# EAGLE design Arduinoboy_1 (EAGLE 7.3.0)
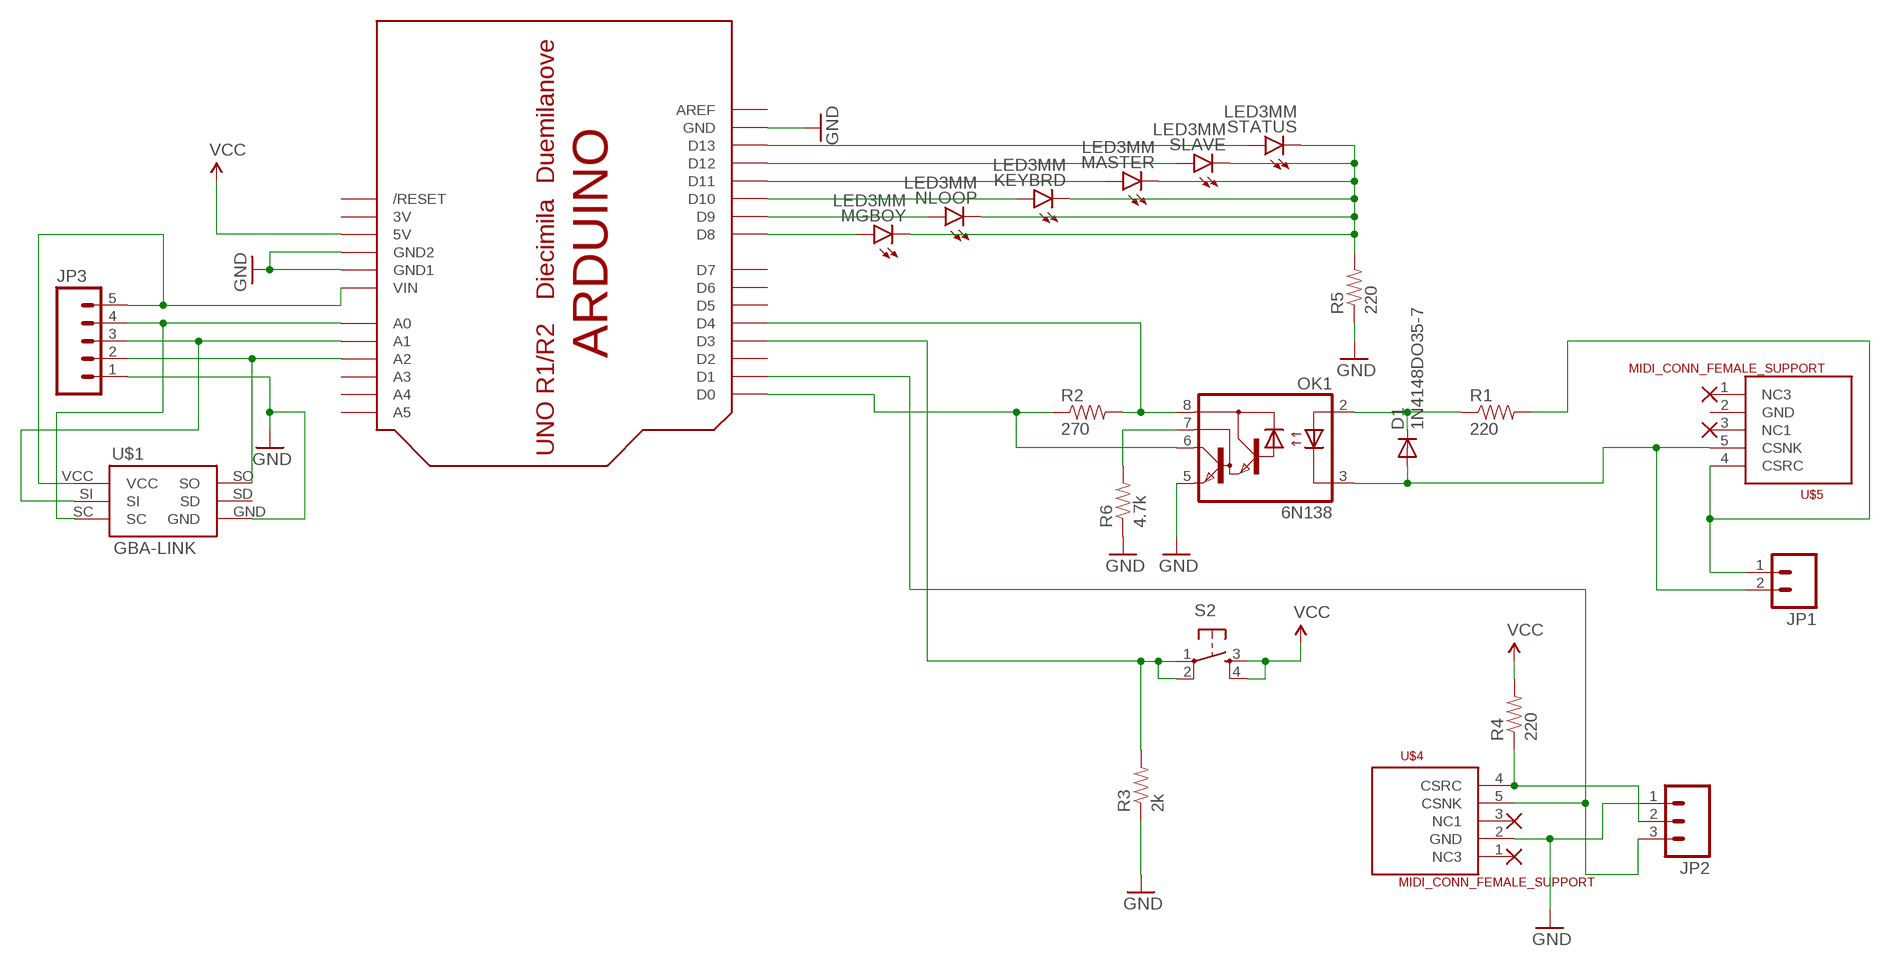
[diagram p0: schematic, sheet 1]

## Parts
D1  1N4148DO35-7  [DO35-7]
JP1  M025MM  [SCREWTERMINAL-5MM-2]
JP2  M03-SCREW-5MM  [SCREWTERMINAL-5MM-3]
JP3  M05SCREW  [SCREWTERMINAL-3.5MM-5]
KEYBRD  LED3MM  [LED3MM]
MASTER  LED3MM  [LED3MM]
MGBOY  LED3MM  [LED3MM]
NLOOP  LED3MM  [LED3MM]
OK1  6N138  [DIL08]
R1  220  RESISTORAXIAL-0.3  [AXIAL-0.3]
R2  270  RESISTORAXIAL-0.3  [AXIAL-0.3]
R3  2k  RESISTORAXIAL-0.3  [AXIAL-0.3]
R4  220  RESISTORAXIAL-0.3  [AXIAL-0.3]
R5  220  RESISTORAXIAL-0.3  [AXIAL-0.3]
R6  4.7k  RESISTORAXIAL-0.3  [AXIAL-0.3]
S2  TAC_SWITCHPTH  [TACTILE-PTH]
SLAVE  LED3MM  [LED3MM]
STATUS  LED3MM  [LED3MM]
U$1  GBA-LINK  [GBA-LINK]
U$3  ARDUINOUNO  [ARDUINO]
U$4  MIDI_CONN_FEMALE_SUPPORT  [DIN_5_FEMALE_SUPPORT]
U$5  MIDI_CONN_FEMALE_SUPPORT  [DIN_5_FEMALE_SUPPORT]

## Nets
GND: JP2.1 JP3.1 OK1.5(GND) R3.P$1 R5.P$1 R6.P$1 U$1.GND U$3.GND U$3.GND1 U$3.GND2 U$4.2(GND)
N$1: D1.C OK1.2(A) R1.P$1
N$2: D1.A JP1.2 OK1.3(C) U$5.5(CSNK)
N$4: R3.P$2 S2.1 S2.2 U$3.D3
N$5: JP2.2 R4.P$1 U$4.4(CSRC)
N$6: MGBOY.A U$3.D8
N$7: JP2.3 U$3.D1 U$4.5(CSNK)
N$8: NLOOP.A U$3.D9
N$9: OK1.8(VCC) R2.P$2 U$3.D4
N$10: OK1.6(VO) R2.P$1 U$3.D0
N$11: KEYBRD.A U$3.D10
N$12: MASTER.A U$3.D11
N$13: SLAVE.A U$3.D12
N$14: STATUS.A U$3.D13
N$15: KEYBRD.K(C) MASTER.K(C) MGBOY.K(C) NLOOP.K(C) R5.P$2 SLAVE.K(C) STATUS.K(C)
N$16: OK1.7(VB) R6.P$2
N$17: JP3.4 U$1.SC U$3.A0
N$18: JP1.1 R1.P$2 U$5.4(CSRC)
N$22: JP3.3 U$1.SI U$3.A1
N$23: JP3.2 U$1.SO U$3.A2
N$24: JP3.5 U$1.VCC U$3.VIN
VCC: R4.P$2 S2.3 S2.4 U$3.5V
Unconnected: U$1.SD U$3.A3 U$3.A4 U$3.A5 U$3.AREF U$3.D2 U$3.D5 U$3.D6 U$3.D7 U$3.RESET(/RESET) U$4.1(NC3) U$4.3(NC1) U$5.1(NC3) U$5.2(GND) U$5.3(NC1)

## Power pins joined to a net without a drawn wire
3V: U$3.3V

## Library data of the parts
D1 = diode:1N4148: DIODE high speed (Philips)
JP1 = SparkFun-Connectors:M02: Standard 2-pin 0.1" header. Use with - straight break away headers ( PRT-00116) - right angle break away headers (PRT-00553) - swiss pins (PRT-00743) - machine pins (PRT-00117) - female headers (PRT-00115) Molex polarized connector foot print use with: PRT-08233 with associated crimp pins and housings. 2.54_SCREWTERM for use with PRT-10571. 3.5mm Screw Terminal footprints for PRT-08084 5mm Screw Terminal footprints for use with PRT-08432; STOREFRONT_ID: PRT-08432
JP2 = SparkFun-Connectors:M03: Header 3 Standard 3-pin 0.1" header. Use with straight break away headers (SKU : PRT-00116), right angle break away headers (PRT-00553), swiss pins (PRT-00743), machine pins (PRT-00117), and female headers (PRT-00115). Molex polarized connector foot print use with SKU : PRT-08232 with associated crimp pins and housings.; STOREFRONT_ID: PRT-08433
JP3 = SparkFun-Connectors:M05: Header 5 Standard 5-pin 0.1" header. Use with straight break away headers (SKU : PRT-00116), right angle break away headers (PRT-00553), swiss pins (PRT-00743), machine pins (PRT-00117), and female headers (PRT-00115). Molex polarized connector foot print use with SKU : PRT-08230 with associated crimp pins and housings.; PROD_ID: Combine 8288+8399
KEYBRD MASTER MGBOY NLOOP SLAVE STATUS = gm-diodes:LED
OK1 = optocoupler:6N138: MOTOROLA OPTO COUPLER
R1-R6 = SparkFun-Resistors:RESISTOR: Resistor Basic schematic elements and footprints for 0603, 1206, and PTH resistors.
S2 = SparkFun-Retired:TAC_SWITCH: Momentary Switch Button commonly used for reset or general input. Spark Fun Electronics SKU : COM-00097 SMT- SWCH-08247
U$1 = David:GBA-LINK
U$3 = adafruit_modif:ARDUINO: Arduino Diecimila/Duemilanove Make a shield with ease, this package has all the named pins as well as the two mounting drill holes and an outline of the USB and DC power connector. The outline is on the DIMENSION layer, so if your board house uses it they will cut the outline to match. http://www.ladyada.net/library/pcb/eaglelibrary.html
U$4 U$5 = SparkFun-Connectors:MIDI_CONN_FEMALE_SUPPORT: MIDI connector with strain relief (DIN-5 female)

## Board
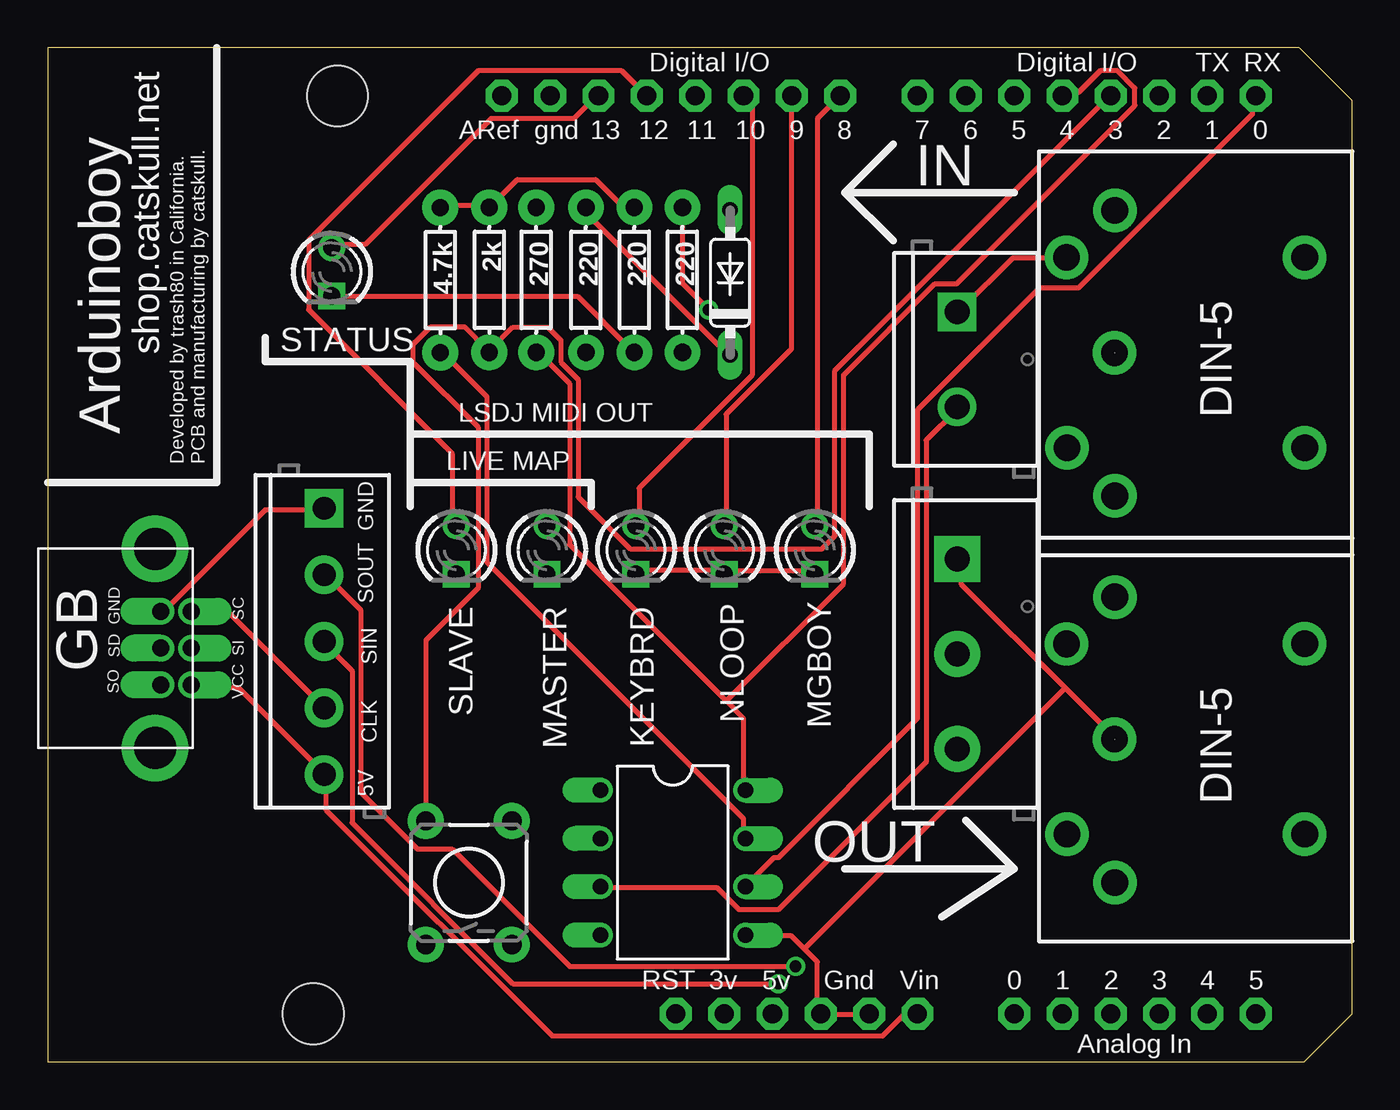
[diagram p1: board, top side]
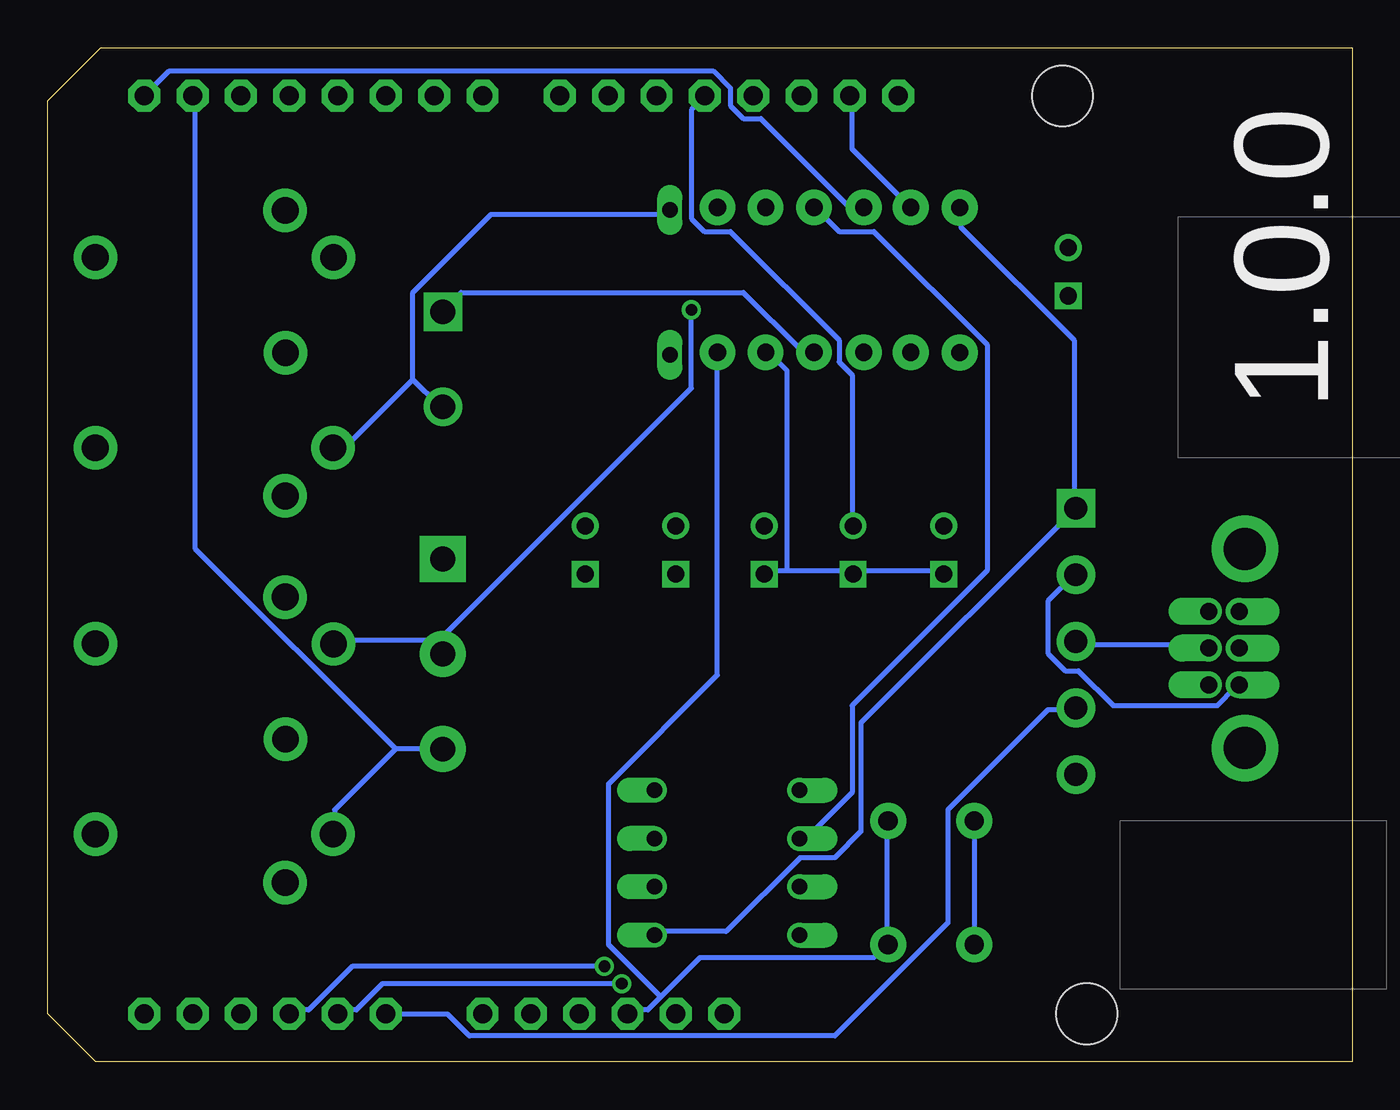
[diagram p2: board, bottom side, seen from below]

Size 68.58 x 53.34 mm. Coordinates in mm from the lower left corner, seen from the top.
Copper layers (1*16): Top 0.035mm / dielectric 1.5mm / Bottom 0.035mm
Design rules "default": minimum track width 10mil, minimum drill 24mil, track to track 8mil, track to pad 8mil, pad to pad 8mil, via to via 8mil, smd to smd 8mil, copper to edge 40mil, drill to drill 8mil, minimum pad ring 10mil, minimum via ring 8mil, stop-mask expansion 4mil, vias tented up to drill 0mil, thermal gap 10mil

### Footprints (pad centres in the part's own frame; a part is rotated, then mirrored left to right if it is on the bottom)
DO35-7 = drill 0.813 long: A 3.81,0; C -3.81,0
SCREWTERMINAL-5MM-2 = drill 1.3 pad 2.032 square: 1 0,0 | drill 1.3 pad 2.032: 2 5,0
SCREWTERMINAL-5MM-3 = drill 1.3 pad 2.413 square: 1 0,0 | drill 1.3 pad 2.413: 2 5,0; 3 10,0
SCREWTERMINAL-3.5MM-5 = drill 1.2 pad 2.032 square: 1 0,0 | drill 1.2 pad 2.032: 2 3.5,0; 3 7,0; 4 10.5,0; 5 14,0
LED3MM = drill 0.9: A -1.27,0 | drill 0.9 square: K 1.27,0
DIL08 = drill 0.813 offset: 1 -3.81,-3.81; 2 -1.27,-3.81; 3 1.27,-3.81; 4 3.81,-3.81; 5 3.81,3.81; 6 1.27,3.81; 7 -1.27,3.81; 8 -3.81,3.81
AXIAL-0.3 = drill 0.9 pad 1.88: P$1 -3.81,0; P$2 3.81,0
TACTILE-PTH = drill 1.016 pad 1.88: 1 -3.251,2.261; 2 3.251,2.261; 3 -3.251,-2.261; 4 3.251,-2.261
GBA-LINK = drill 0.9 pad 1.27 offset: GND 7.18,1.67; SC 7.18,0.06; SD 5.25,1.67; SI 5.25,0.06; SO 3.32,1.67; VCC 3.32,0.06 | drill 2.2 pad 3.5: SHEILD1 0,1.965; SHEILD2 10.47,1.965
ARDUINO = drill 1 pad 1.676 octagon: 3V 35.56,2.54; 5V 38.1,2.54; A0 50.8,2.54; A1 53.34,2.54; A2 55.88,2.54; A3 58.42,2.54; A4 60.96,2.54; A5 63.5,2.54; AREF 23.876,50.8; D0 63.5,50.8; D1 60.96,50.8; D2 58.42,50.8; D3 55.88,50.8; D4 53.34,50.8; D5 50.8,50.8; D6 48.26,50.8; D7 45.72,50.8; D8 41.656,50.8; D9 39.116,50.8; D10 36.576,50.8; D11 34.036,50.8; D12 31.496,50.8; D13 28.956,50.8; GND 26.416,50.8; GND1 43.18,2.54; GND2 40.64,2.54; RESET 33.02,2.54; VIN 45.72,2.54 | hole 3.2: 15.24,50.8; 13.97,2.54
DIN_5_FEMALE_SUPPORT = drill 1.4 pad 2.286: 1 7.94,3.6; 2 0.46,3.61; 3 -7.07,3.6; 4 5.47,6.13; 5 -4.53,6.12; 6 -4.53,-6.382; 7 5.478,-6.382

### Placement (x,y rotation side)
D1  35.88,40.98 90 top
JP1  47.81,39.45 270 top
JP2  47.81,26.45 270 top
JP3  14.53,29.12 270 top
KEYBRD  30.92,26.92 270 top
MASTER  26.24,26.92 270 top
MGBOY  40.32,26.92 270 top
NLOOP  35.56,26.92 270 top
OK1  32.86,10.48 270 top
R1  28.3,41.12 270 top
R2  25.68,41.12 270 top
R3  23.22,41.12 270 top
R4  33.37,41.12 270 top
R5  30.84,41.12 270 top
R6  20.64,41.11 270 top
S2  22.14,9.42 90 top
SLAVE  21.48,26.92 270 top
STATUS  14.94,41.55 270 top
U$1  7.62,16.51 90 top
U$3  0,0 0 top
U$4  59.69,16.51 90 top
U$5  59.69,36.83 90 top

### Tracks (layer width: path | path; a pad name or v marks a point on that pad's centre or on a via)
GND
  Top 0.254: 39.78,5.94 40.46,5.26 40.46,2.74 U$3.GND2 40.69,2.52 42.98,2.52 U$3.GND1 | 39.78,5.94 39.09,6.63 36.8,6.63 OK1.5 | 53.49,19.66 48.01,25.15 48.01,26.29 JP2.1 | 53.49,19.66 56.01,17.14 U$4.2 | 53.49,19.66 39.78,5.94 | U$1.GND 6.17,23.77 11.43,29.03 14.4,29.03 JP3.1 | R6.P$1 20.8,45.03 23.09,45.03 R3.P$1 23.32,45.03 24.69,46.41 28.8,46.41 30.18,45.03 30.63,45.03 R5.P$1
  Bottom 0.254: U$3.GND 26.29,50.75 26.29,48.01 23.32,45.03 R3.P$1 | R6.P$1 20.57,44.81 20.57,43.89 14.63,37.95 14.63,29.26 JP3.1 14.63,29.03 25.83,17.83 25.83,12.12 27.2,10.74 29.03,10.74 32.92,6.86 36.58,6.86 OK1.5
N$1
  Top 0.254: D1.C 35.66,37.26 28.12,44.81 R1.P$1
  Bottom 0.254: OK1.2 29.03,11.89 28.57,11.89 26.29,14.17 26.29,18.75 19.2,25.83 19.2,37.72 25.15,43.66 26.98,43.66 28.12,44.81 R1.P$1
N$2
  Top 0.254: OK1.3 29.26,9.14 35.2,9.14 36.35,8 38.41,8 46.18,15.77 46.18,32.69 47.78,34.29 JP1.2
  Bottom 0.254: 49.38,35.89 49.38,40.46 45.26,44.58 35.89,44.58 D1.A | 49.38,35.89 48.01,34.52 JP1.2 | 49.38,35.89 52.81,32.46 53.49,32.46 U$5.5
N$4
  Top 0.254: U$3.D3 55.78,50.75 41.38,36.35 41.38,27.66 40.69,26.98 30.63,26.98 27.89,29.72 27.89,35.89 26.98,36.8 26.98,37.95 26.29,38.63 24.46,38.63 23.32,37.49 R3.P$2 23.09,37.49 21.95,38.63 20.12,38.63 19.2,37.72 19.2,36.8 22.63,33.38 22.63,24.92 19.89,22.17 19.89,12.8 S2.2
  Bottom 0.254: S2.1 19.89,12.57 S2.2
N$5  (via drill 0.61)
  Top 0.254: v34.75,39.55 33.38,40.92 33.38,44.81 R4.P$1
  Bottom 0.254: v34.75,39.55 34.75,35.43 47.78,22.4 47.78,22.17 | 47.78,22.17 47.78,21.49 JP2.2 47.78,22.17 | 47.78,22.17 53.49,22.17 U$4.4
N$6
  Top 0.254: U$3.D8 40.46,49.61 40.46,28.35 MGBOY.A
N$7
  Bottom 0.254: 50.29,16.46 60.81,26.98 60.81,50.75 U$3.D1 | 50.29,16.46 48.01,16.46 JP2.3 | 50.29,16.46 53.49,13.26 53.49,12.12 U$4.5
N$8
  Top 0.254: NLOOP.A 35.66,28.35 35.66,34.06 39.09,37.49 39.09,50.75 U$3.D9
N$9
  Top 0.254: 35.66,18.97 27.43,27.2 27.43,35.66 25.83,37.26 R2.P$2 | 35.66,18.97 36.58,18.06 36.58,14.4 OK1.8 | 35.66,18.97 41.83,25.15 41.83,36.12 46.63,40.92 47.78,40.92 57.15,50.29 57.15,51.21 56.24,52.12 55.32,52.12 54.18,50.98 53.49,50.98 U$3.D4
N$10
  Top 0.254: OK1.6 36.8,9.37 38.18,10.74 38.41,10.74 45.72,18.06 45.72,34.29 52.12,40.69 54.18,40.69 63.32,49.84 63.32,50.75 U$3.D0
  Bottom 0.254: U$3.D0 62.18,52.12 33.6,52.12 32.69,51.21 32.69,50.29 32,49.61 31.09,49.61 26.52,45.03 25.83,45.03 R2.P$1
N$11
  Top 0.254: KEYBRD.A 31.09,28.35 31.09,30.18 37.03,36.12 37.03,50.29 36.58,50.75 U$3.D10
N$12
  Bottom 0.254: MASTER.A 26.29,28.35 26.29,36.12 26.98,36.8 26.98,37.95 32.69,43.66 34.06,43.66 34.75,44.35 34.75,50.06 34.06,50.75 U$3.D11
N$13
  Top 0.254: U$3.D12 30.18,52.12 22.63,52.12 13.72,43.2 13.72,39.55 21.26,32 21.26,28.35 SLAVE.A
N$14
  Top 0.254: STATUS.A 15.09,42.98 16.69,42.98 23.32,49.61 27.66,49.61 28.8,50.75 U$3.D13
N$15
  Top 0.254: KEYBRD.K 31.09,25.83 35.43,25.83 NLOOP.K 35.66,25.83 40.23,25.83 MGBOY.K | STATUS.K 15.09,40.23 27.89,40.23 30.63,37.49 R5.P$2
  Bottom 0.254: SLAVE.K 21.49,25.83 26.06,25.83 MASTER.K 26.29,25.83 29.72,25.83 | 29.72,25.83 30.86,25.83 KEYBRD.K | 29.72,25.83 29.72,36.35 30.63,37.26 R5.P$2
N$16
  Top 0.254: OK1.7 36.58,11.89 36.58,12.8 23.09,26.29 23.09,34.98 20.8,37.26 R6.P$2
N$17
  Top 0.254: U$1.SC 7.77,23.55 9.6,23.55 14.4,18.75 JP3.4
  Bottom 0.254: U$3.A0 50.75,2.52 47.55,2.52 46.41,1.37 27.2,1.37 21.26,7.32 21.26,13.26 16,18.52 14.63,18.52 JP3.4
N$18
  Top 0.254: U$5.4 53.49,42.29 50.75,42.29 48.01,39.55 JP1.1
  Bottom 0.254: R1.P$2 28.35,37.49 29.03,37.49 32,40.46 46.86,40.46 47.78,39.55 JP1.1
N$22  (via drill 0.61)
  Top 0.254: v38.41,4.12 24.46,4.12 16,12.57 16,20.57 14.63,21.95 JP3.3
  Bottom 0.254: U$1.SI 7.77,21.95 14.4,21.95 JP3.3 | v38.41,4.12 50.98,4.12 52.35,2.74 53.26,2.74 U$3.A1
N$23  (via drill 0.61)
  Top 0.254: v39.32,5.03 27.43,5.03 21.26,11.2 19.43,11.2 16.46,14.17 16.46,23.77 14.63,25.6 JP3.2
  Bottom 0.254: U$1.SO 6.17,19.66 7.09,18.75 12.57,18.75 14.4,20.57 15.09,20.57 16,21.49 16,24.23 14.63,25.6 JP3.2 | v39.32,5.03 52.58,5.03 54.86,2.74 55.78,2.74 U$3.A2
N$24
  Top 0.254: U$1.VCC 7.77,19.66 10.06,19.66 14.4,15.32 JP3.5 14.63,15.09 14.63,13.26 26.52,1.37 43.89,1.37 45.03,2.52 45.72,2.52 U$3.VIN
VCC
  Bottom 0.254: 36.35,3.43 34.29,5.49 25.15,5.49 24.46,6.17 | 36.35,3.43 37.03,2.74 37.95,2.74 U$3.5V | 24.46,6.17 24.46,12.57 S2.4 | 24.46,6.17 S2.3 | 36.35,3.43 39.09,6.17 39.09,14.63 33.38,20.34 33.38,37.26 R4.P$2

### Text on the board
tNames: shop.catskull.net | TX | RX | IN | LSDJ MIDI OUT | Arduinoboy | Developed by trash80 in California. / PCB and manufacturing by catskull. | LIVE MAP | GND | SOUT | SIN | GB | CLK | 5V | OUT
bNames: 1.0.0